# Altium schematic sheet MCU.SchDoc
size A; SheetNumber: 4; SheetTotal: 7
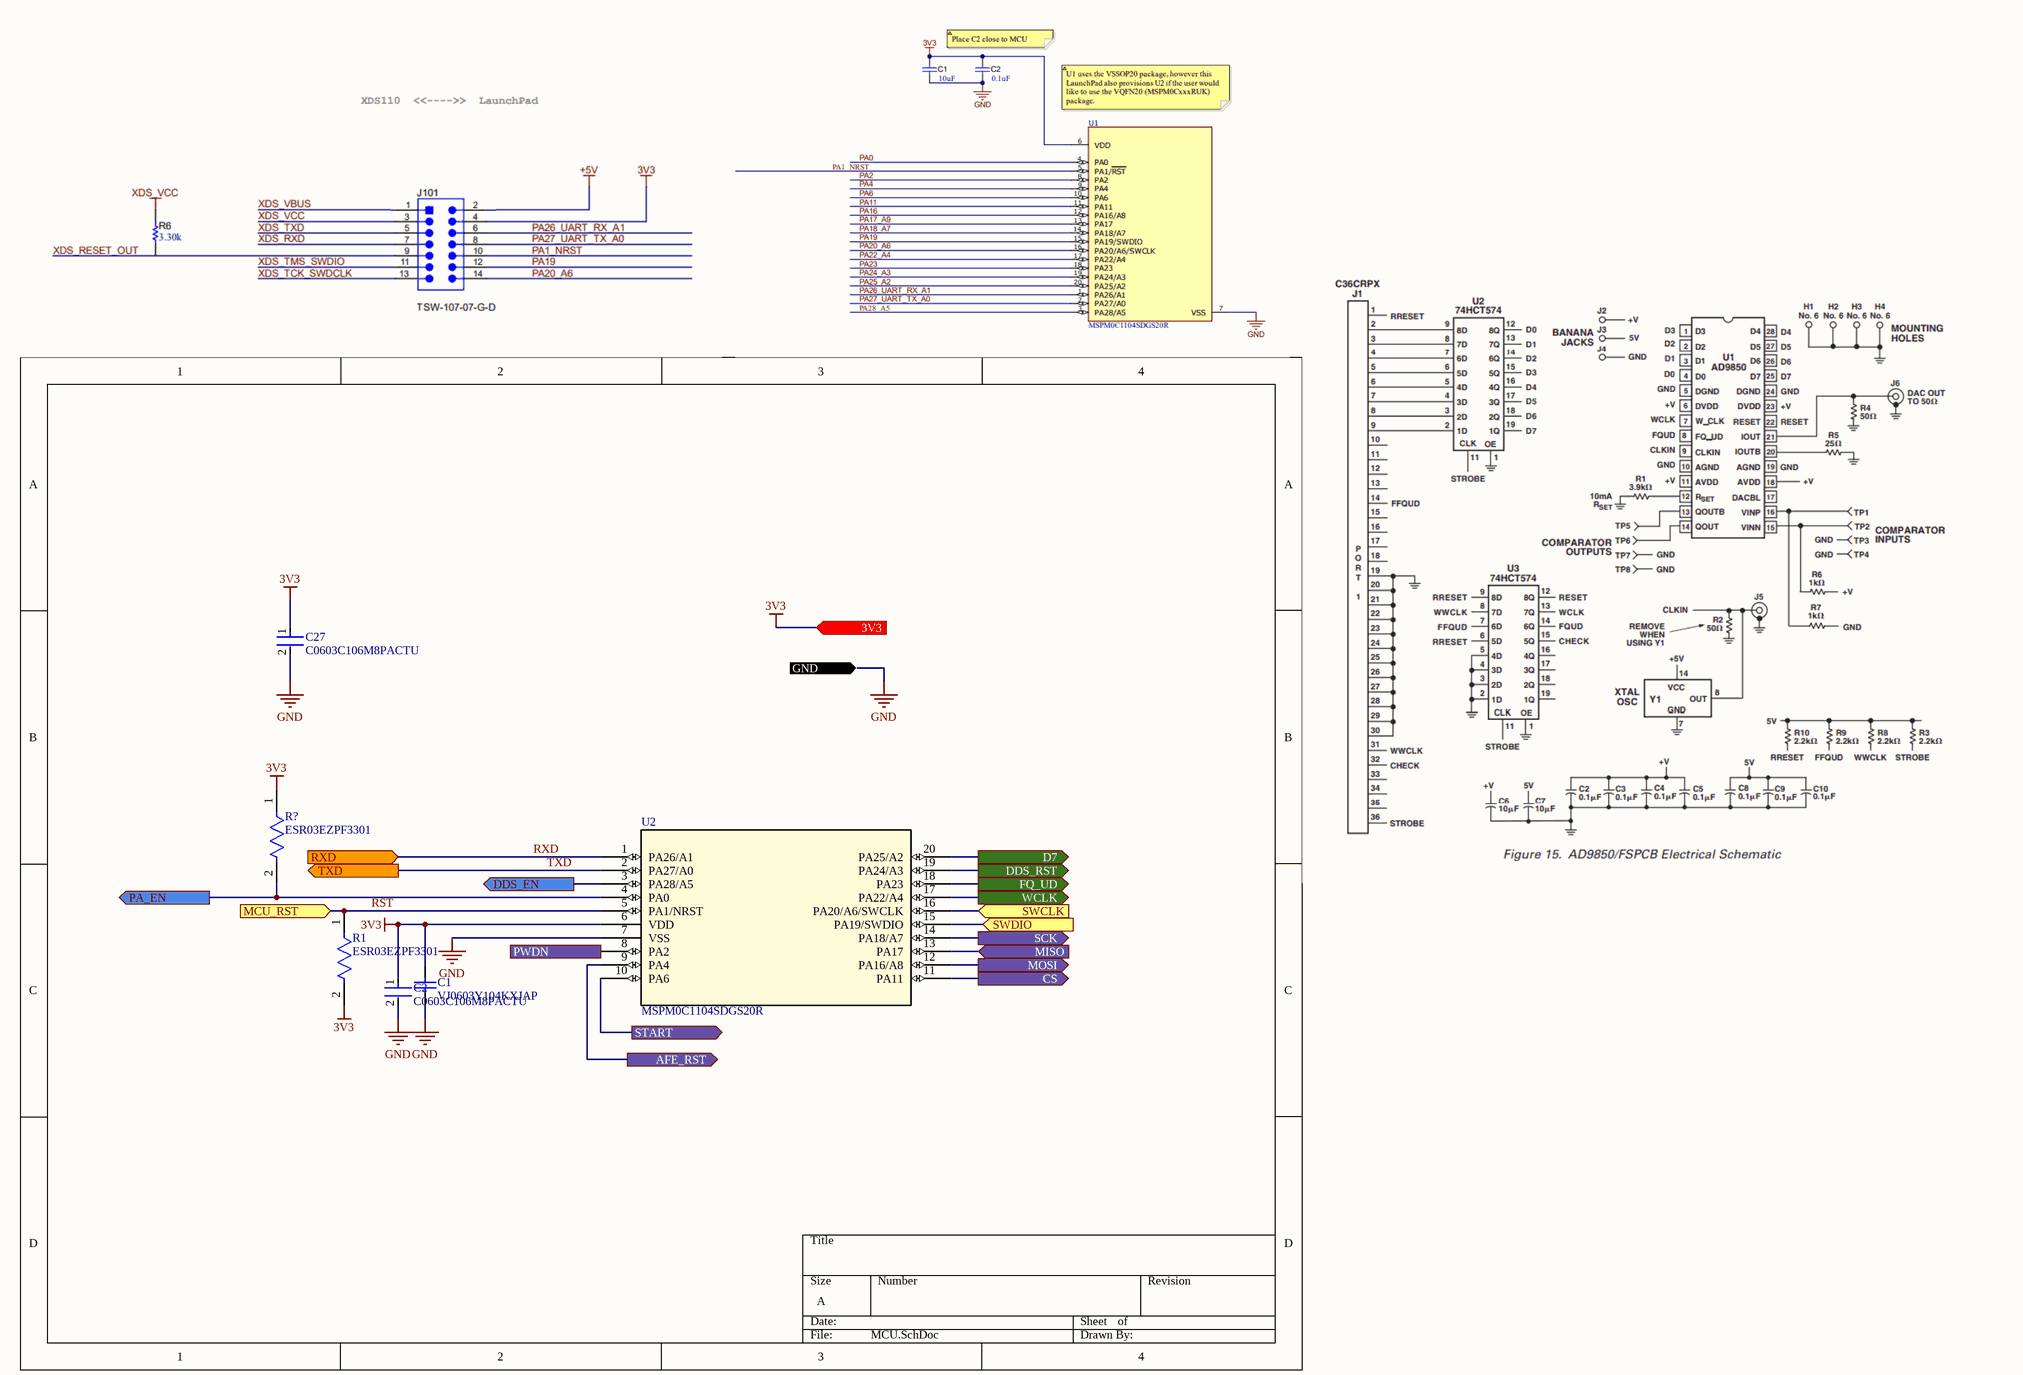
[diagram p0: MCU.SchDoc]

## Parts
C1  VJ0603Y104KXJAP  [CAPC1608X92X38NL15T08]
C2  C0603C106M8PACTU  [FP-C0603C106M8PACTU-MFG]
C27  C0603C106M8PACTU  [FP-C0603C106M8PACTU-MFG]
R1  ESR03EZPF3301  [FP-ESR03-IPC_A]
R?  ESR03EZPF3301  [FP-ESR03-IPC_A]
U2  MSPM0C1104SDGS20R  [DGS0020A_TEX]

## Ports
3V3 (in), AFE_RST (out), CS (out), D7 (out), DDS_EN (out), DDS_RST (out), FQ_UD (out), GND (in), MCU_RST (in), MISO (in), MOSI (out), PA_EN (out), PWDN (out), RXD (in), SCK (out), START (out), SWCLK (in), SWDIO (in), TXD (out), WCLK (out)

## Nets
3V3: C1.2 C2.1 C27.1 R1.2 R?.1 U2.6(VDD) ; port 3V3
GND: C1.1 C2.2 C27.2 U2.7(VSS) ; port GND
AFE_RST: U2.9(PA4) ; port AFE_RST
CS: U2.11(PA11) ; port CS
D7: U2.20(PA25/A2) ; port D7
DDS_EN: U2.3(PA28/A5) ; port DDS_EN
DDS_RST: U2.19(PA24/A3) ; port DDS_RST
FQ_UD: U2.18(PA23) ; port FQ_UD
MISO: U2.13(PA17) ; port MISO
MOSI: U2.12(PA16/A8) ; port MOSI
PA_EN: R?.2 U2.4(PA0) ; port PA_EN
PWDN: U2.8(PA2) ; port PWDN
RST: R1.1 U2.5(PA1/NRST) ; port MCU_RST
RXD: U2.1(PA26/A1) ; port RXD
SCK: U2.14(PA18/A7) ; port SCK
START: U2.10(PA6) ; port START
SWCLK: U2.16(PA20/A6/SWCLK) ; port SWCLK
SWDIO: U2.15(PA19/SWDIO) ; port SWDIO
TXD: U2.2(PA27/A0) ; port TXD
WCLK: U2.17(PA22/A4) ; port WCLK

## Library data of the parts
C1 = CMP-2006-01211-1: Manufacturer: Vitramon; Part Number: VJ0603Y104KXJAP
C2 C27 = CMP-03020-034654-1: CAP CER 10UF 10V X5R 0603; RoHS Compliant: Yes
R1 R? = CMP-08839-028747-1: 3.3kΩ ±1% 0.25W 0603 Anti-Surge Chip Resistor AEC-Q200; Temperature Coefficient: 100ppm/°C; Resistance: 3.3kR; Max Power Dissipation: 250mW; Tolerance: 1%; Min Operating Temperature: -55°C; Features: Automotive AEC-Q200; Max Operating Temperature: 155°C; Number of Terminations: 2; Series: ESR; Packaging: Tape and Reel; Resistor Type: Thick Film; RoHS Compliant: Yes; Case/Package: 0603
U2 = MSPM0C1104SDGS20R: 24MHz ArmÂ® CortexÂ®-M0+ MCU with 16KB flash, 1KB SRAM, 12-bit ADC 20-VSSOP -40 to 125; Manufacturer_Name: Texas Instruments; Copyright: Copyright (C) 2025 Ultra Librarian. All rights reserved.; Manufacturer_Part_Number: MSPM0C1104SDGS20R; Datasheet: https://www.ti.com/lit/gpn/mspm0c1104; RefDes: RefDes; Type: Type